# EAGLE design VauTRIOv1_0 (EAGLE 6.5.0)
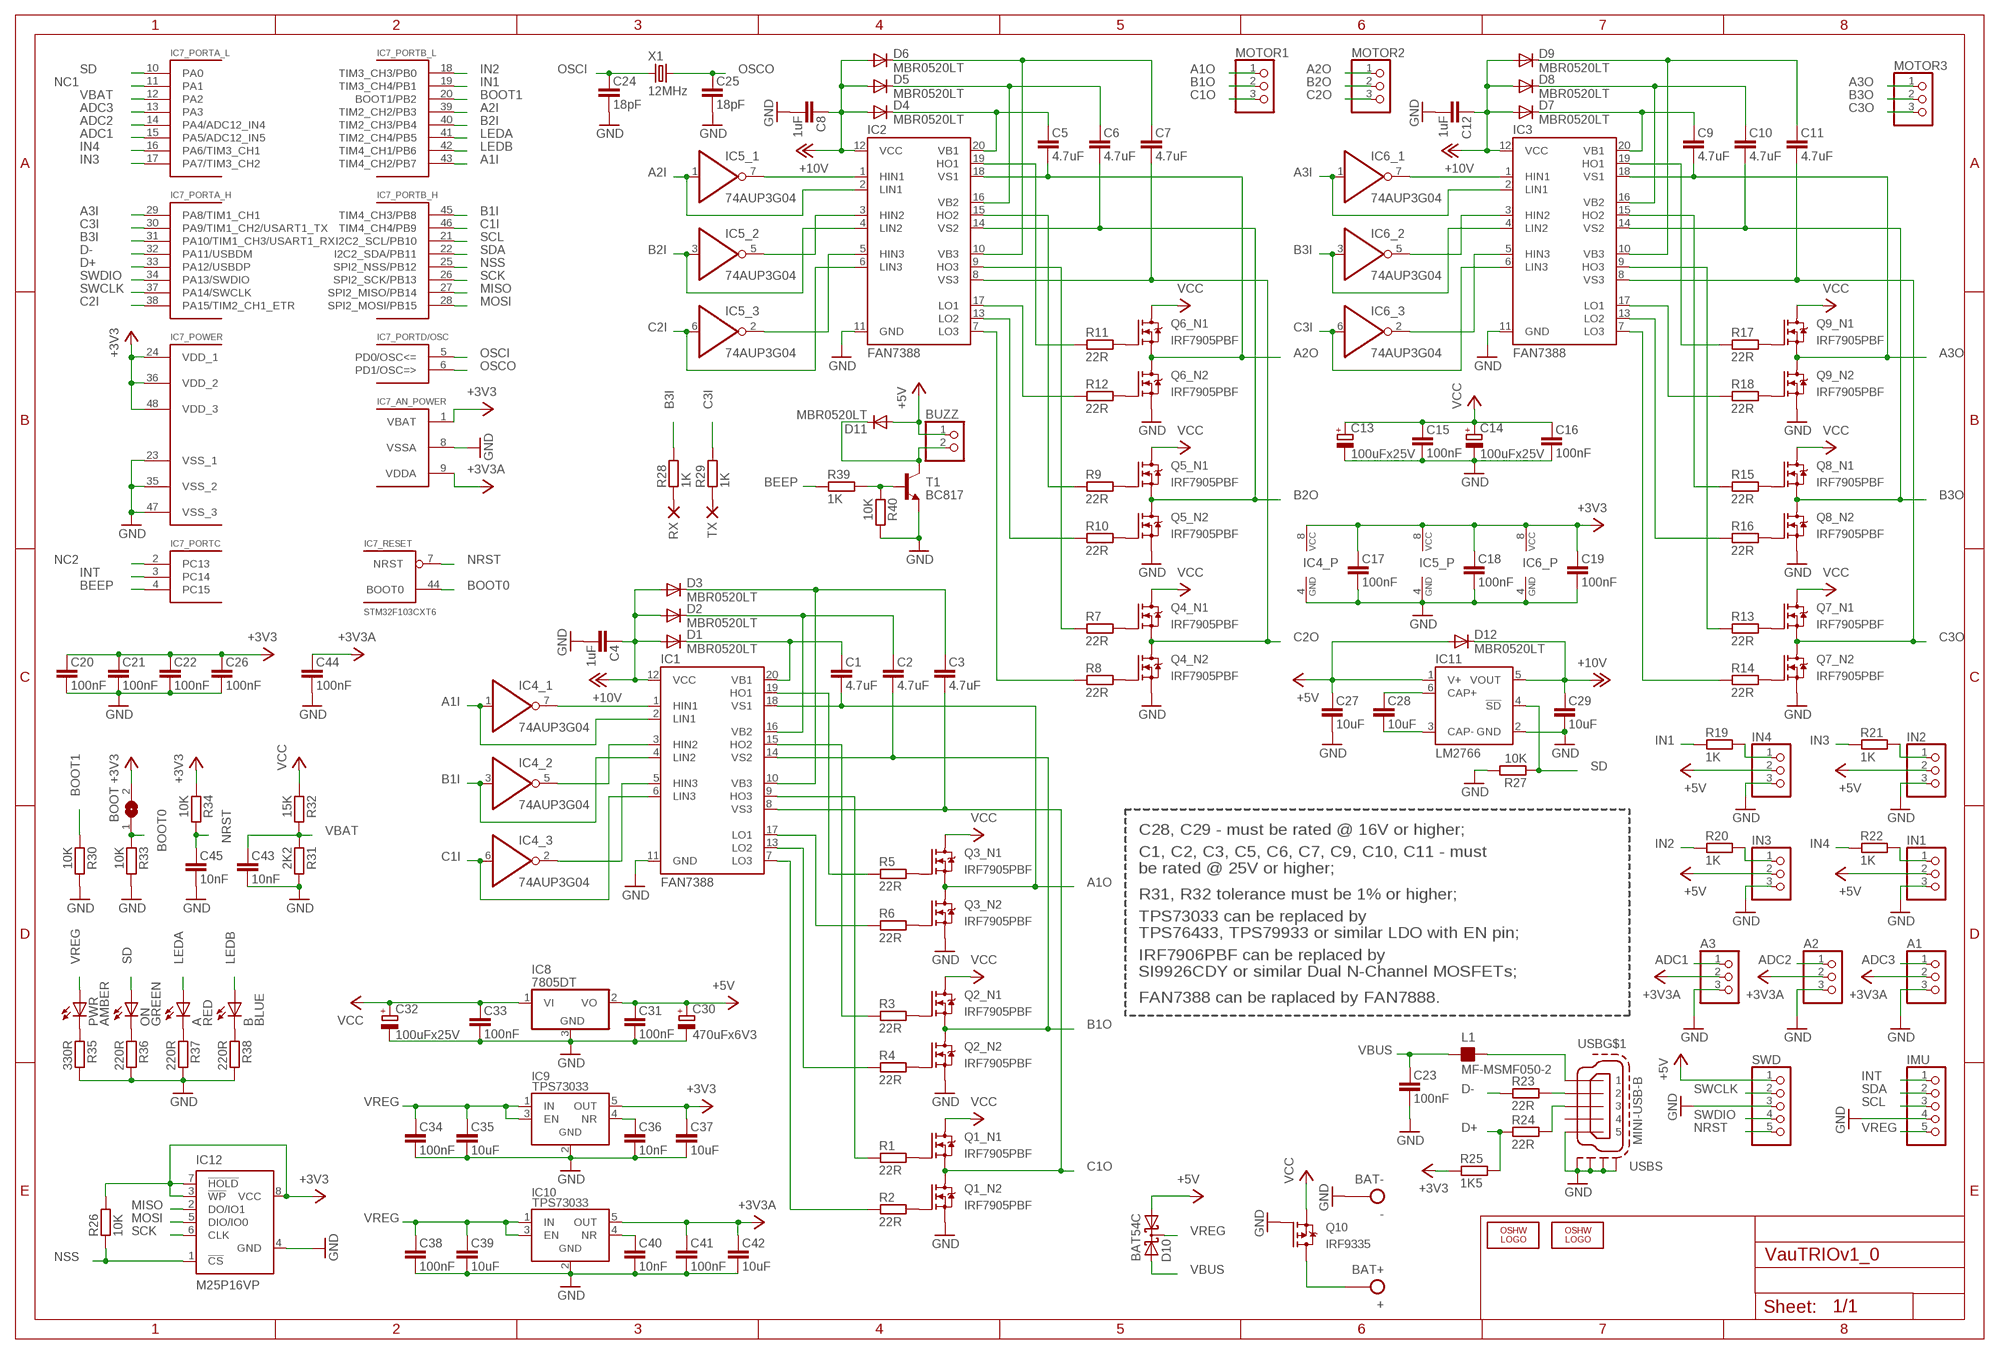
[diagram p0: schematic, sheet 1]

## Parts
+  BAT+  POWER-PAD-20S  [PAD20S]
-  BAT-  POWER-PAD-20R  [PAD20R]
A  RED  LEDCHIPLED_0805  [CHIPLED_0805]
A1  PINHD-1X3  [1X03]
A2  PINHD-1X3  [1X03]
A3  PINHD-1X3  [1X03]
B  BLUE  LEDCHIPLED_0805  [CHIPLED_0805]
BOOT  SJ  [SJ]
BUZZ  PINHD-1X2  [1X02]
C1  4.7uF  C_EU_C0805  [C0805]
C2  4.7uF  C_EU_C0805  [C0805]
C3  4.7uF  C_EU_C0805  [C0805]
C4  1uF  C_EU_C0603G  [C0603G]
C5  4.7uF  C_EU_C0805  [C0805]
C6  4.7uF  C_EU_C0805  [C0805]
C7  4.7uF  C_EU_C0805  [C0805]
C8  1uF  C_EU_C0603G  [C0603G]
C9  4.7uF  C_EU_C0805  [C0805]
C10  4.7uF  C_EU_C0805  [C0805]
C11  4.7uF  C_EU_C0805  [C0805]
C12  1uF  C_EU_C0603G  [C0603G]
C13  100uFx25V  CPOL-EUE2.5-7  [E2,5-7]
C14  100uFx25V  CPOL-EUE2.5-7  [E2,5-7]
C15  100nF  C_EU_C0603G  [C0603G]
C16  100nF  C_EU_C0603G  [C0603G]
C17  100nF  C_EU_C0603G  [C0603G]
C18  100nF  C_EU_C0603G  [C0603G]
C19  100nF  C_EU_C0603G  [C0603G]
C20  100nF  C_EU_C0603G  [C0603G]
C21  100nF  C_EU_C0603G  [C0603G]
C22  100nF  C_EU_C0603G  [C0603G]
C23  100nF  C_EU_C0603G  [C0603G]
C24  18pF  C_EU_C0603G  [C0603G]
C25  18pF  C_EU_C0603G  [C0603G]
C26  100nF  C_EU_C0603G  [C0603G]
C27  10uF  C_EU_C0805G  [C0805G]
C28  10uF  C_EU_C0805  [C0805]
C29  10uF  C_EU_C0805G  [C0805G]
C30  470uFx6V3  CPOL-EUSMCD  [SMC_D]
C31  100nF  C_EU_C0603G  [C0603G]
C32  100uFx25V  CPOL-EUSMCD  [SMC_D]
C33  100nF  C_EU_C0603G  [C0603G]
C34  100nF  C_EU_C0603G  [C0603G]
C35  10uF  C_EU_C0805G  [C0805G]
C36  10nF  C_EU_C0603G  [C0603G]
C37  10uF  C_EU_C0805G  [C0805G]
C38  100nF  C_EU_C0603G  [C0603G]
C39  10uF  C_EU_C0805G  [C0805G]
C40  10nF  C_EU_C0603G  [C0603G]
C41  100nF  C_EU_C0603G  [C0603G]
C42  10uF  C_EU_C0805G  [C0805G]
C43  10nF  C_EU_C0603G  [C0603G]
C44  100nF  C_EU_C0603G  [C0603G]
C45  10nF  C_EU_C0603G  [C0603G]
D1  MBR0520LT  [SOD123]
D2  MBR0520LT  [SOD123]
D3  MBR0520LT  [SOD123]
D4  MBR0520LT  [SOD123]
D5  MBR0520LT  [SOD123]
D6  MBR0520LT  [SOD123]
D7  MBR0520LT  [SOD123]
D8  MBR0520LT  [SOD123]
D9  MBR0520LT  [SOD123]
D10  BAT54C  [SOT23]
D11  MBR0520LT  [SOD123]
D12  MBR0520LT  [SOD123]
IC1  FAN7388  [SOIC-20]
IC2  FAN7388  [SOIC-20]
IC3  FAN7388  [SOIC-20]
IC4  74AUP3G04  [R-PDSO-G8]
IC5  74AUP3G04  [R-PDSO-G8]
IC6  74AUP3G04  [R-PDSO-G8]
IC7  STM32F103CXT6  [LQFP48]
IC8  7805DT  [TO252]
IC9  TPS73033  TPS769XX  [SOT23-5]
IC10  TPS73033  TPS769XX  [SOT23-5]
IC11  LM2766  [SOT23-6]
IC12  M25P16VP  W25X40BVSNIG  [SOIC-8]
IMU  PINHD-1X5  [1X05]
IN1  PINHD-1X3  [1X03]
IN2  PINHD-1X3  [1X03]
IN3  PINHD-1X3  [1X03]
IN4  PINHD-1X3  [1X03]
L1  MF-MSMF050-2  FB_0603  [L0603]
LOGO1  OSHW_LOGO_10MILX0350-NT  [OSHW_10X350_NOTEXT]
LOGO2  OSHW_LOGO_FILLX0150-NT  [OSHW_FILLX150_NOTEXT]
MOTOR1  PINHD-1X3MOT  [1X03M]
MOTOR2  PINHD-1X3MOT  [1X03M]
MOTOR3  PINHD-1X3MOT  [1X03M]
ON  GREEN  LEDCHIPLED_0805  [CHIPLED_0805]
PWR  AMBER  LEDCHIPLED_0805  [CHIPLED_0805]
Q1  IRF7905PBF  [SOIC-8]
Q2  IRF7905PBF  [SOIC-8]
Q3  IRF7905PBF  [SOIC-8]
Q4  IRF7905PBF  [SOIC-8]
Q5  IRF7905PBF  [SOIC-8]
Q6  IRF7905PBF  [SOIC-8]
Q7  IRF7905PBF  [SOIC-8]
Q8  IRF7905PBF  [SOIC-8]
Q9  IRF7905PBF  [SOIC-8]
Q10  IRF9335  [SOIC-8]
R1  22R  R_EU_R0603  [R0603]
R2  22R  R_EU_R0603  [R0603]
R3  22R  R_EU_R0603  [R0603]
R4  22R  R_EU_R0603  [R0603]
R5  22R  R_EU_R0603  [R0603]
R6  22R  R_EU_R0603  [R0603]
R7  22R  R_EU_R0603  [R0603]
R8  22R  R_EU_R0603  [R0603]
R9  22R  R_EU_R0603  [R0603]
R10  22R  R_EU_R0603  [R0603]
R11  22R  R_EU_R0603  [R0603]
R12  22R  R_EU_R0603  [R0603]
R13  22R  R_EU_R0603  [R0603]
R14  22R  R_EU_R0603  [R0603]
R15  22R  R_EU_R0603  [R0603]
R16  22R  R_EU_R0603  [R0603]
R17  22R  R_EU_R0603  [R0603]
R18  22R  R_EU_R0603  [R0603]
R19  1K  R_EU_R0603  [R0603]
R20  1K  R_EU_R0603  [R0603]
R21  1K  R_EU_R0603  [R0603]
R22  1K  R_EU_R0603  [R0603]
R23  22R  R_EU_R0603  [R0603]
R24  22R  R_EU_R0603  [R0603]
R25  1K5  R_EU_R0603  [R0603]
R26  10K  R_EU_R0603  [R0603]
R27  10K  R_EU_R0603G  [R0603G]
R28  1K  R_EU_R0603  [R0603]
R29  1K  R_EU_R0603  [R0603]
R30  10K  R_EU_R0603G  [R0603G]
R31  2K2  R_EU_R0603G  [R0603G]
R32  15K  R_EU_R0603  [R0603]
R33  10K  R_EU_R0603G  [R0603G]
R34  10K  R_EU_R0603  [R0603]
R35  330R  R_EU_R0603G  [R0603G]
R36  220R  R_EU_R0603G  [R0603G]
R37  220R  R_EU_R0603G  [R0603G]
R38  220R  R_EU_R0603G  [R0603G]
R39  1K  R_EU_R0603  [R0603]
R40  10K  R_EU_R0603G  [R0603G]
RX  PAD-SMD10R  [SMD10R]
SWD  PINHD-1X5  [1X05]
T1  BC817  BC817-16LT1SMD  [SOT23-BEC]
TX  PAD-SMD10R  [SMD10R]
USB  MINI-USB-B  MINI-USB-SCHIELD-32005-201  [32005-201]
X1  12MHz  CRYSTALHC49S  [HC49/S]

## Nets
+3V3: BOOT.2 C17.1 C18.1 C19.1 C20.1 C21.1 C22.1 C26.1 C37.1 IC4.8(_P:VCC) IC5.8(_P:VCC) IC6.8(_P:VCC) IC7.1(_AN_POWER:VBAT) IC7.24(_POWER:VDD_1) IC7.36(_POWER:VDD_2) IC7.48(_POWER:VDD_3) IC9.5(OUT) IC12.3(!WP) IC12.7(!HOLD) IC12.8(VCC) R25.1 R26.2 R34.1
+3V3A: A1.2 A2.2 A3.2 C41.1 C42.1 C44.1 IC7.9(_AN_POWER:VDDA) IC10.5(OUT)
+5V: BUZZ.1 C27.1 C30.+ C31.1 D10.1(A1) D11.A D12.A IC8.2(VO) IC11.1(V+) IN1.2 IN2.2 IN3.2 IN4.2 SWD.1
+12V: C4.1 C8.1 C12.1 C29.1 D1.A D2.A D3.A D4.A D5.A D6.A D7.A D8.A D9.A D12.C IC1.12(VCC) IC2.12(VCC) IC3.12(VCC) IC11.5(VOUT) ; supply symbol labelled +10V
A1I: IC1.2(LIN1) IC4.1(_1:A) IC7.43(_PORTB_L:TIM4_CH2/PB7)
A1O [power]: C1.2 IC1.18(VS1) MOTOR1.1 Q3.3(_N1:N-S) Q3.7(_N2:N-D) Q3.8(_N2:N-D)
A2I: IC2.2(LIN1) IC5.1(_1:A) IC7.39(_PORTB_L:TIM2_CH2/PB3)
A2O [power]: C5.2 IC2.18(VS1) MOTOR2.1 Q6.3(_N1:N-S) Q6.7(_N2:N-D) Q6.8(_N2:N-D)
A3I: IC3.2(LIN1) IC6.1(_1:A) IC7.29(_PORTA_H:PA8/TIM1_CH1)
A3O [power]: C9.2 IC3.18(VS1) MOTOR3.1 Q9.3(_N1:N-S) Q9.7(_N2:N-D) Q9.8(_N2:N-D)
ADC1: A3.1 IC7.15(_PORTA_L:PA5/ADC12_IN5)
ADC2: A2.1 IC7.14(_PORTA_L:PA4/ADC12_IN4)
ADC3: A1.1 IC7.13(_PORTA_L:PA3)
B1I: IC1.4(LIN2) IC4.3(_2:A) IC7.45(_PORTB_H:TIM4_CH3/PB8)
B1O [power]: C2.2 IC1.14(VS2) MOTOR1.2 Q2.3(_N1:N-S) Q2.7(_N2:N-D) Q2.8(_N2:N-D)
B2I: IC2.4(LIN2) IC5.3(_2:A) IC7.40(_PORTB_L:TIM2_CH3/PB4)
B2O [power]: C6.2 IC2.14(VS2) MOTOR2.2 Q5.3(_N1:N-S) Q5.7(_N2:N-D) Q5.8(_N2:N-D)
B3I: IC3.4(LIN2) IC6.3(_2:A) IC7.31(_PORTA_H:PA10/TIM1_CH3/USART1_RX) R28.2
B3O [power]: C10.2 IC3.14(VS2) MOTOR3.2 Q8.3(_N1:N-S) Q8.7(_N2:N-D) Q8.8(_N2:N-D)
BAT+ [power]: +.P$1 Q10.5(P-D) Q10.6(P-D) Q10.7(P-D) Q10.8(P-D)
BEEP: IC7.4(_PORTC:PC15) R39.1
BOOT0: BOOT.1 IC7.44(_RESET:BOOT0) R33.1
BOOT1: IC7.20(_PORTB_L:BOOT1/PB2) R30.1
C1I: IC1.6(LIN3) IC4.6(_3:A) IC7.46(_PORTB_H:TIM4_CH4/PB9)
C1O [power]: C3.2 IC1.8(VS3) MOTOR1.3 Q1.3(_N1:N-S) Q1.7(_N2:N-D) Q1.8(_N2:N-D)
C2I: IC2.6(LIN3) IC5.6(_3:A) IC7.38(_PORTA_H:PA15/TIM2_CH1_ETR)
C2O [power]: C7.2 IC2.8(VS3) MOTOR2.3 Q4.3(_N1:N-S) Q4.7(_N2:N-D) Q4.8(_N2:N-D)
C3I: IC3.6(LIN3) IC6.6(_3:A) IC7.30(_PORTA_H:PA9/TIM1_CH2/USART1_TX) R29.2
C3O [power]: C11.2 IC3.8(VS3) MOTOR3.3 Q7.3(_N1:N-S) Q7.7(_N2:N-D) Q7.8(_N2:N-D)
D+: IC7.33(_PORTA_H:PA12/USBDP) R24.1 R25.2
D-: IC7.32(_PORTA_H:PA11/USBDM) R23.1
GND: -.P$1 A1.3 A2.3 A3.3 C4.2 C8.2 C12.2 C13.- C14.- C15.2 C16.2 C17.2 C18.2 C19.2 C20.2 C21.2 C22.2 C23.2 C24.2 C25.2 C26.2 C27.2 C29.2 C30.- C31.2 C32.- C33.2 C34.2 C35.2 C36.2 C37.2 C38.2 C39.2 C40.2 C41.2 C42.2 C43.2 C44.2 C45.2 IC1.11(GND) IC2.11(GND) IC3.11(GND) IC4.4(_P:GND) IC5.4(_P:GND) IC6.4(_P:GND) IC7.8(_AN_POWER:VSSA) IC7.23(_POWER:VSS_1) IC7.35(_POWER:VSS_2) IC7.47(_POWER:VSS_3) IC8.3(GND) IC9.2(GND) IC10.2(GND) IC11.2(GND) IC12.4(GND) IMU.4 IN1.3 IN2.3 IN3.3 IN4.3 Q1.1(_N2:N-S) Q2.1(_N2:N-S) Q3.1(_N2:N-S) Q4.1(_N2:N-S) Q5.1(_N2:N-S) Q6.1(_N2:N-S) Q7.1(_N2:N-S) Q8.1(_N2:N-S) Q9.1(_N2:N-S) Q10.4(P-G) R27.2 R30.2 R31.2 R33.2 R35.2 R36.2 R37.2 R38.2 R40.2 SWD.3 T1.E USB.5 USB.M1(S:S1) USB.M2(S:S2) USB.M3(S:S3) USB.M4(S:S4)
IN1: IC7.19(_PORTB_L:TIM3_CH4/PB1) R19.1
IN2: IC7.18(_PORTB_L:TIM3_CH3/PB0) R20.1
IN3: IC7.17(_PORTA_L:PA7/TIM3_CH2) R21.1
IN4: IC7.16(_PORTA_L:PA6/TIM3_CH1) R22.1
INT: IC7.3(_PORTC:PC14) IMU.1
LEDA: A.A IC7.41(_PORTB_L:TIM2_CH4/PB5)
LEDB: B.A IC7.42(_PORTB_L:TIM4_CH1/PB6)
MISO: IC7.27(_PORTB_H:SPI2_MISO/PB14) IC12.2(DO/IO1)
MOSI: IC7.28(_PORTB_H:SPI2_MOSI/PB15) IC12.5(DIO/IO0)
N$1: IC1.19(HO1) R5.1
N$2: Q5.4(_N1:N-G) R9.2
N$3: Q5.2(_N2:N-G) R10.2
N$4: Q2.4(_N1:N-G) R3.2
N$5: Q2.2(_N2:N-G) R4.2
N$6: Q3.4(_N1:N-G) R5.2
N$7: Q3.2(_N2:N-G) R6.2
N$8: IC1.3(HIN2) IC4.5(_2:Y)
N$9: C1.1 D1.C IC1.20(VB1)
N$10: C2.1 D2.C IC1.16(VB2)
N$11: C3.1 D3.C IC1.10(VB3)
N$12: Q6.4(_N1:N-G) R11.2
N$13: Q6.2(_N2:N-G) R12.2
N$14: IN4.1 R19.2
N$15: Q1.4(_N1:N-G) R1.2
N$16: Q1.2(_N2:N-G) R2.2
N$17: IC1.1(HIN1) IC4.7(_1:Y)
N$18: PWR.C R35.1
N$19: IC1.5(HIN3) IC4.2(_3:Y)
N$20: ON.C R36.1
N$21: R23.2 USB.2
N$22: A.C R37.1
N$23: C5.1 D4.C IC2.20(VB1)
N$24: C6.1 D5.C IC2.16(VB2)
N$25: IC1.17(LO1) R6.1
N$26: IC1.15(HO2) R3.1
N$27: IC1.13(LO2) R4.1
N$28: IC1.7(LO3) R2.1
N$29: IC1.9(HO3) R1.1
N$30: C7.1 D6.C IC2.10(VB3)
N$31: Q4.4(_N1:N-G) R7.2
N$32: Q4.2(_N2:N-G) R8.2
N$33: IC2.1(HIN1) IC5.7(_1:Y)
N$34: IN3.1 R20.2
N$35: IC2.3(HIN2) IC5.5(_2:Y)
N$36: R24.2 USB.3
N$37: IC2.5(HIN3) IC5.2(_3:Y)
N$38: IN2.1 R21.2
N$39: IC2.17(LO1) R12.1
N$40: IC2.15(HO2) R9.1
N$41: IC2.13(LO2) R10.1
N$42: IC2.7(LO3) R8.1
N$43: IC2.9(HO3) R7.1
N$44: IC2.19(HO1) R11.1
N$45: Q8.4(_N1:N-G) R15.2
N$46: Q8.2(_N2:N-G) R16.2
N$47: Q9.4(_N1:N-G) R17.2
N$48: Q9.2(_N2:N-G) R18.2
N$49: IN1.1 R22.2
N$50: C9.1 D7.C IC3.20(VB1)
N$51: C10.1 D8.C IC3.16(VB2)
N$52: C11.1 D9.C IC3.10(VB3)
N$53: Q7.4(_N1:N-G) R13.2
N$54: Q7.2(_N2:N-G) R14.2
N$55: IC3.1(HIN1) IC6.7(_1:Y)
N$56: L1.2 USB.1
N$57: IC3.3(HIN2) IC6.5(_2:Y)
N$58: B.C R38.1
N$59: IC3.5(HIN3) IC6.2(_3:Y)
N$60: BUZZ.2 D11.C T1.C
N$61: IC3.17(LO1) R18.1
N$62: IC3.15(HO2) R15.1
N$63: IC3.13(LO2) R16.1
N$64: IC3.7(LO3) R14.1
N$65: IC3.9(HO3) R13.1
N$66: IC3.19(HO1) R17.1
N$68: C28.1 IC11.6(CAP+)
N$69: C28.2 IC11.3(CAP-)
N$70: R28.1 RX.PAD(P)
N$71: R29.1 TX.PAD(P)
N$72: R39.2 R40.1 T1.B
N$76: C40.1 IC10.4(NR)
N$77: C36.1 IC9.4(NR)
NC1: IC7.11(_PORTA_L:PA1)
NC2: IC7.2(_PORTC:PC13)
NRST: C45.1 IC7.7(_RESET:NRST) R34.2 SWD.5
NSS: IC7.25(_PORTB_H:SPI2_NSS/PB12) IC12.1(!CS) R26.1
OSCI: C24.1 IC7.5(_PORTD/OSC:PD0/OSC<=) X1.1
OSCO: C25.1 IC7.6(_PORTD/OSC:PD1/OSC=>) X1.2
SCK: IC7.26(_PORTB_H:SPI2_SCK/PB13) IC12.6(CLK)
SCL: IC7.21(_PORTB_H:I2C2_SCL/PB10) IMU.3
SD: IC7.10(_PORTA_L:PA0) IC11.4(!SD) ON.A R27.1
SDA: IC7.22(_PORTB_H:I2C2_SDA/PB11) IMU.2
SWCLK: IC7.37(_PORTA_H:PA14/SWCLK) SWD.2
SWDIO: IC7.34(_PORTA_H:PA13/SWDIO) SWD.4
VBAT: C43.1 IC7.12(_PORTA_L:PA2) R31.1 R32.2
VBUS: C23.1 D10.2(A2) L1.1
VCC [power]: C13.+ C14.+ C15.1 C16.1 C32.+ C33.1 IC8.1(VI) Q1.5(_N1:N-D) Q1.6(_N1:N-D) Q2.5(_N1:N-D) Q2.6(_N1:N-D) Q3.5(_N1:N-D) Q3.6(_N1:N-D) Q4.5(_N1:N-D) Q4.6(_N1:N-D) Q5.5(_N1:N-D) Q5.6(_N1:N-D) Q6.5(_N1:N-D) Q6.6(_N1:N-D) Q7.5(_N1:N-D) Q7.6(_N1:N-D) Q8.5(_N1:N-D) Q8.6(_N1:N-D) Q9.5(_N1:N-D) Q9.6(_N1:N-D) Q10.1(P-S) Q10.2(P-S) Q10.3(P-S) R32.1
VREG: C34.1 C35.1 C38.1 C39.1 D10.3(CC) IC9.1(IN) IC9.3(EN) IC10.1(IN) IC10.3(EN) IMU.5 PWR.A
Unconnected: USB.4

## Notes on the sheet
- C28, C29 - must be rated @ 16V or higher;
- C1, C2, C3, C5, C6, C7, C9, C10, C11 - must
  be rated @ 25V or higher;
- R31, R32 tolerance must be 1% or higher;
- TPS73033 can be replaced by
  TPS76433, TPS79933 or similar LDO with EN pin;
- IRF7906PBF can be replaced by
  SI9926CDY or similar Dual N-Channel MOSFETs;
- FAN7388 can be raplaced by FAN7888.

## Library data of the parts
+ - = svBGC:POWER-PAD
A B ON PWR = svBGC:LED
A1-A3 IN1-IN4 MOTOR1-MOTOR3 = svBGC:PINHD-1X3: PIN HEADER
BOOT = svBGC:SJ: SMD solder JUMPER
BUZZ = svBGC:PINHD-1X2: PIN HEADER
C1-C12 C15-C29 C31 C33-C45 = svBGC:C_EU_
C13 C14 C30 C32 = svBGC:CPOL-EU: POLARIZED CAPACITOR, European symbol
D1-D9 D11 D12 = svBGC:MBR0520LT: SCHOTTKY BARRIER RECTIFIER Source: http://onsemi.com .. MBR0520LT1-D.pdf
D10 = svBGC:BAT54C: Schottky Diodes Source: Fairchild .. BAT54.pdf
IC1-IC3 = svBGC:FAN7388: FAIRCHILD SEMICONDUCTORS 3 Half-Bridge Gate-Drive IC
IC4-IC6 = svBGC:74*3G04
IC7 = svBGC:STM32F103CXT6
IC8 = linear:78*: Positive VOLTAGE REGULATOR Source: http://cache.national.com/ds/LM/LM78L05.pdf http://www.fairchildsemi.com/ds/LM/LM7805.pdf
IC9 IC10 = svBGC:TPS769XX: Texas Instruments LDO Regulator
IC11 = svBGC:LM2766: LM2766 - Switched Capacitor Voltage Converter
IC12 = svBGC:W25X: Winbond SPI Flash Memory
IMU SWD = svBGC:PINHD-1X5: PIN HEADER
L1 = svBGC:FB_: FERRITE BEAD
LOGO1 = ohw-logo:OSHW_LOGO_10MIL
LOGO2 = ohw-logo:OSHW_LOGO_FILL
Q1-Q9 = svBGC:IRF7905
Q10 = svBGC:IRF9335
R1-R40 = svBGC:R_EU_
RX TX = dpads:PAD: WIRE PAD Standard US Drill Sizes and SMD pads
T1 = svBGC:BC817*: NPN Transistor
USB = svBGC:MINI-USB-SCHIELD-: MINI USB-B Conector Source: www.cypressindustries.com; OC_FARNELL: unknown; OC_NEWARK: unknown
X1 = svBGC:CRYSTAL: CRYSTAL; OC_FARNELL: 1667008; OC_NEWARK: unknown

## Net classes
0 default: width 0.203 mm, drill 0.305 mm, clearance 0.203 mm
1 power: width 0.254 mm, drill 0.305 mm, clearance 0.305 mm

## Board
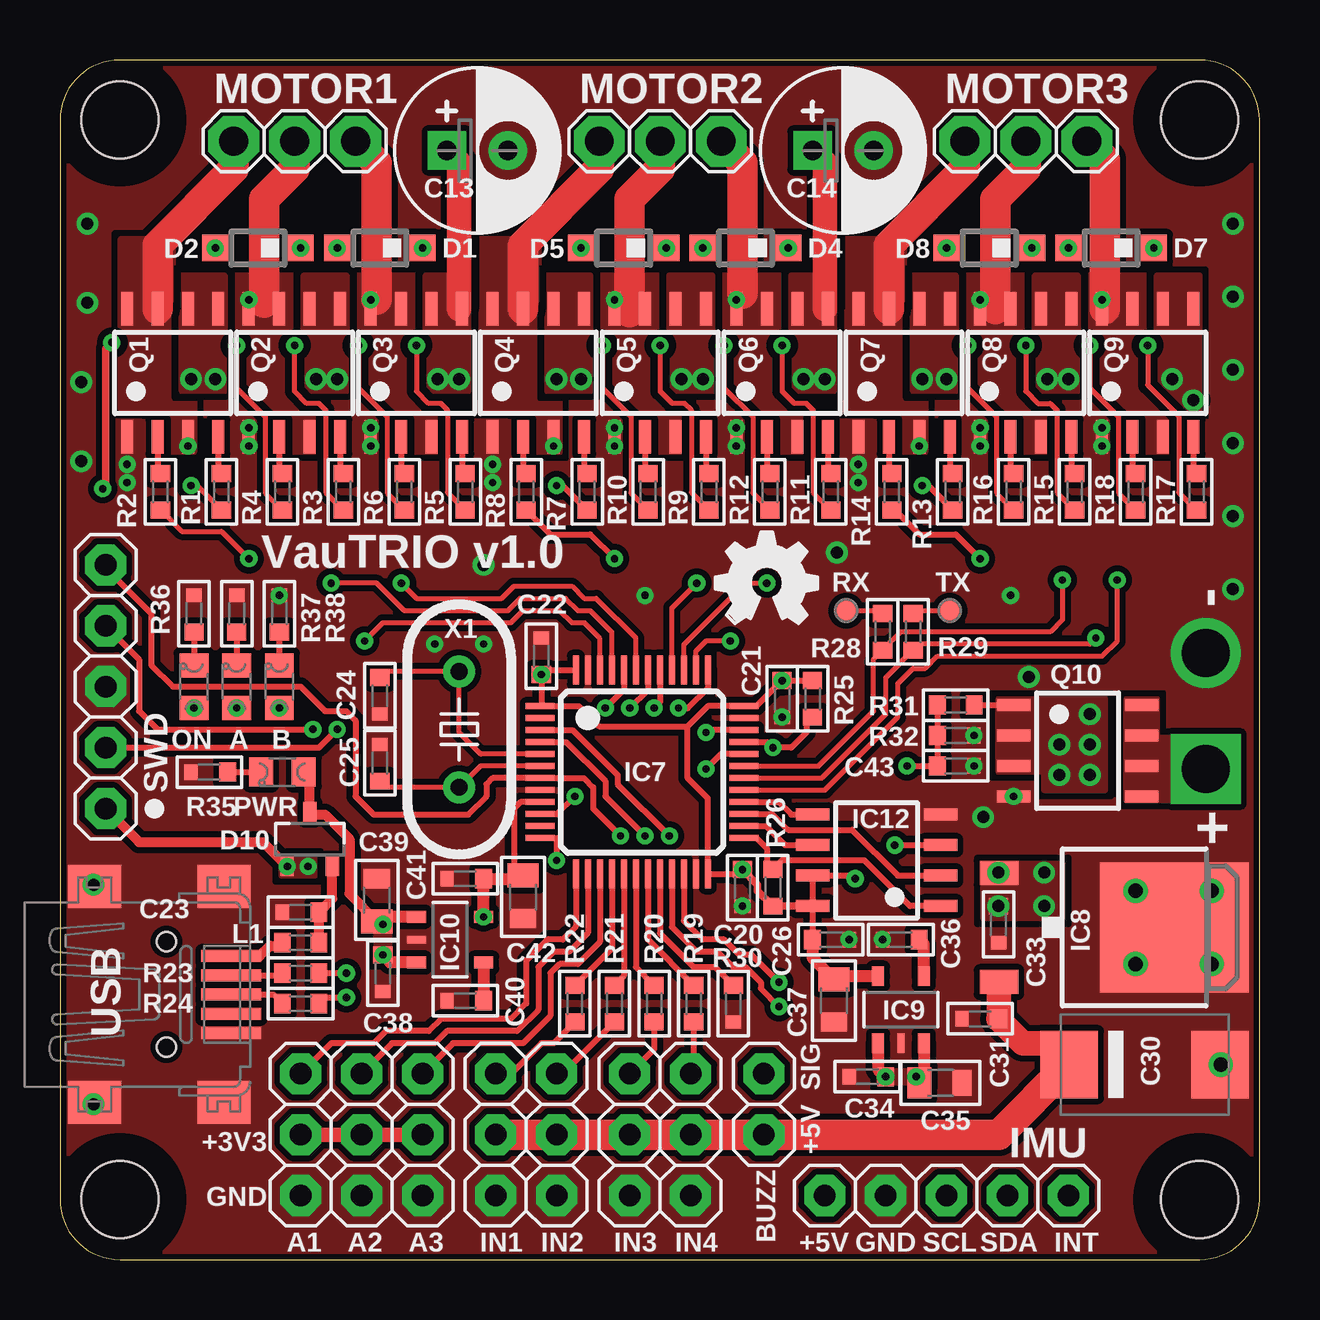
[diagram p1: board, top side]
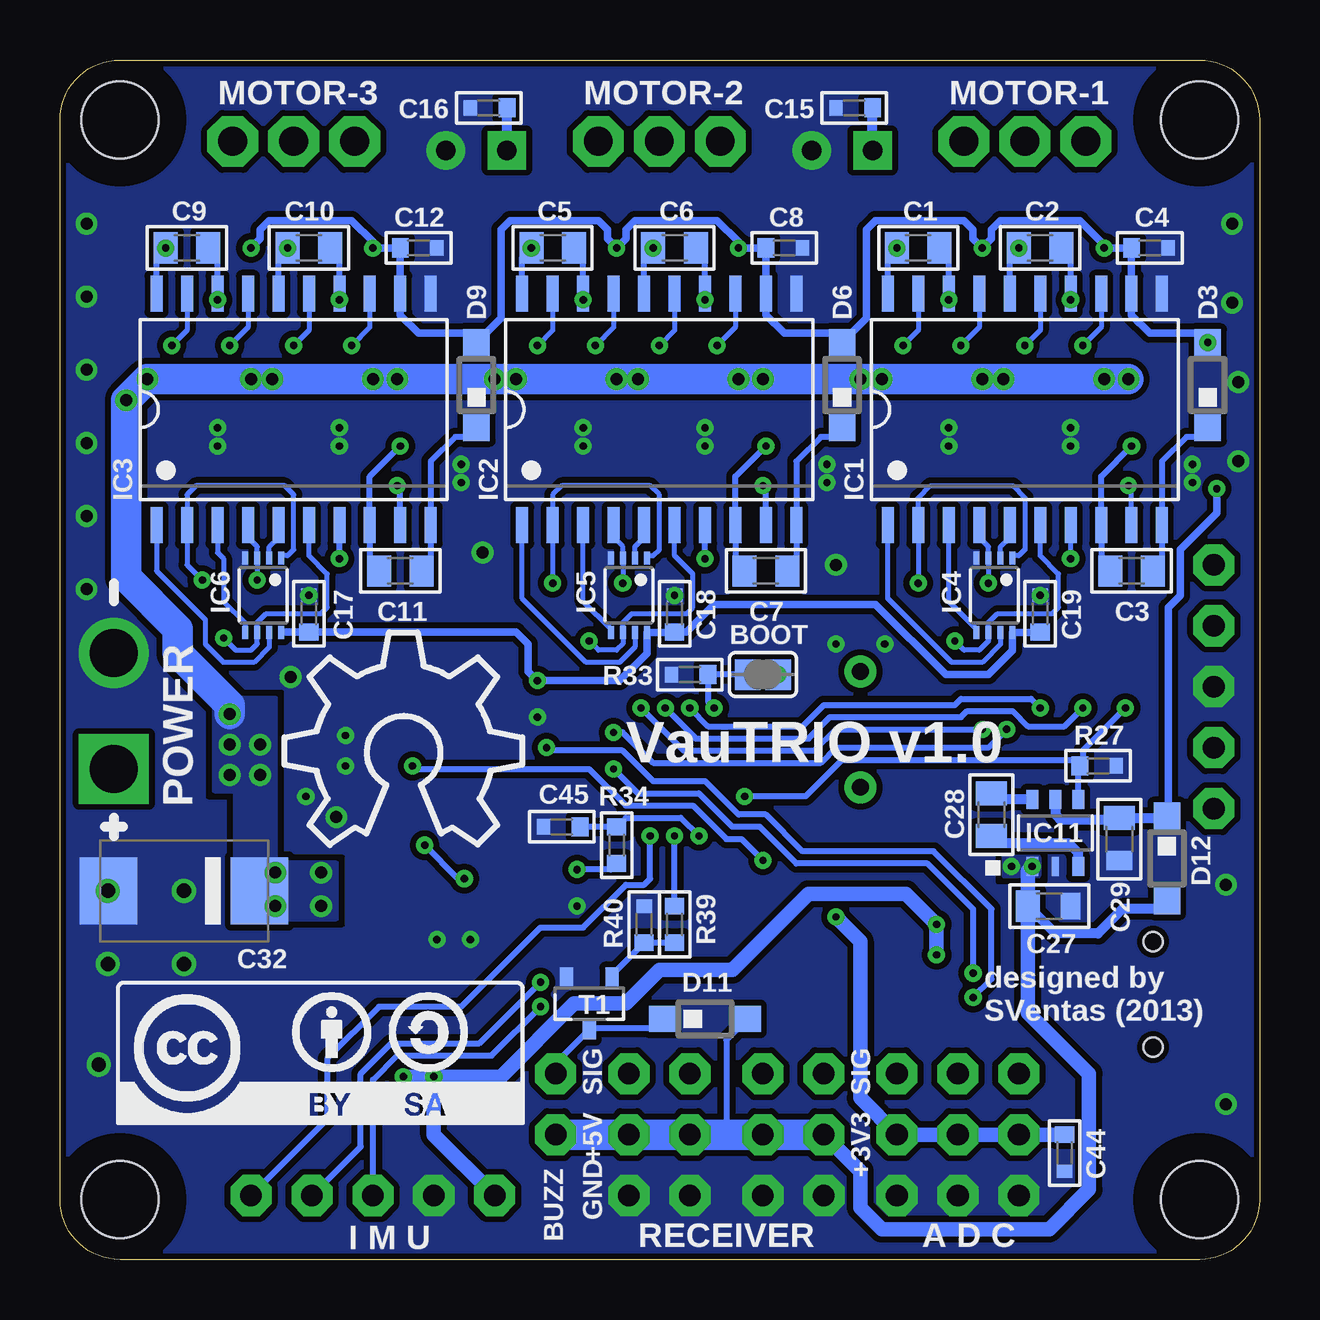
[diagram p2: board, bottom side, seen from below]

Size 50 x 50 mm. Coordinates in mm from the lower left corner, seen from the top.
Outline: 2.5,0 47.5,0 arc90 50,2.5 50,47.5 arc90 47.5,50 2.5,50 arc90 0,47.5 0,2.5 arc90 2.5,0
Copper layers (1*16): Top 0.035mm / dielectric 1.5mm / Bottom 0.035mm
Design rules "default *": minimum track width 8mil, minimum drill 12mil, track to track 8mil, track to pad 8mil, pad to pad 8mil, via to via 8mil, smd to smd 0mil, copper to edge 10mil, drill to drill 8mil, minimum pad ring 10mil, minimum via ring 8mil, stop-mask expansion 4mil, vias tented up to drill 20mil, thermal gap 10mil
Holes 3.2 mm at 2.5,47.5 47.5,47.5 2.5,2.5 47.5,2.5
tRestrict: area 0,45 to 5,50; area 45,45 to 50,50; area 45,0 to 50,5; area 0,0 to 5,5
bRestrict: area 0,45 to 5,50; area 45,45 to 50,50; area 45,0 to 50,5; area 0,0 to 5,5

### Footprints (pad centres in the part's own frame; a part is rotated, then mirrored left to right if it is on the bottom)
PAD20S = drill 2 square: P$1 0,0
PAD20R = drill 2: P$1 0,0
CHIPLED_0805 = smd 1.2 x 1: A 0,-0.889; C 0,0.889
1X03 = drill 0.9 octagon: 1 -2.54,0; 2 0,0; 3 2.54,0
SJ = smd 1.067 x 1.27: 1 -0.635,0; 2 0.635,0
1X02 = drill 0.9 octagon: 1 -1.27,0; 2 1.27,0
C0805 = smd 1 x 1.3: 1 -0.889,0; 2 0.889,0
C0603G = smd 0.7 x 0.8: 1 -0.762,0 | smd 0.548 x 0.648: 2 0.762,0
E2,5-7 = drill 0.813 pad 1.6 square: + -1.27,0 | drill 0.813 pad 1.6: - 1.27,0
C0805G = smd 1 x 1.3: 1 -0.889,0 | smd 0.797 x 1.097: 2 0.889,0
SMC_D = smd 2.4 x 2.8: + -3.15,0; - 3.15,0
SOD123 = smd 1.1 x 1.1: A 1.778,0; C -1.778,0
SOT23 = smd 0.55 x 0.8: 1 -0.94,-1.143; 2 0.94,-1.143; 3 0,1.143
SOIC-20 = smd 0.5 x 1.5: 1 -5.715,-4.826; 2 -4.445,-4.826; 3 -3.175,-4.826; 4 -1.905,-4.826; 5 -0.635,-4.826; 6 0.635,-4.826; 7 1.905,-4.826; 8 3.175,-4.826; 9 4.445,-4.826; 10 5.715,-4.826; 11 5.715,4.826; 12 4.445,4.826; 13 3.175,4.826; 14 1.905,4.826; 15 0.635,4.826; 16 -0.635,4.826; 17 -1.905,4.826; 18 -3.175,4.826; 19 -4.445,4.826; 20 -5.715,4.826
R-PDSO-G8 = smd 0.25 x 0.55: 1 -0.75,-1.55; 2 -0.25,-1.55; 3 0.25,-1.55; 4 0.75,-1.55; 5 0.75,1.55; 6 0.25,1.55; 7 -0.25,1.55; 8 -0.75,1.55
LQFP48 = smd 0.25 x 1.2: 1 -2.75,-4.25; 2 -2.25,-4.25; 3 -1.75,-4.25; 4 -1.25,-4.25; 5 -0.75,-4.25; 6 -0.25,-4.25; 7 0.25,-4.25; 8 0.75,-4.25; 9 1.25,-4.25; 10 1.75,-4.25; 11 2.25,-4.25; 12 2.75,-4.25; 25 2.75,4.25; 26 2.25,4.25; 27 1.75,4.25; 28 1.25,4.25; 29 0.75,4.25; 30 0.25,4.25; 31 -0.25,4.25; 32 -0.75,4.25; 33 -1.25,4.25; 34 -1.75,4.25; 35 -2.25,4.25; 36 -2.75,4.25 | smd 1.2 x 0.25: 13 4.25,-2.75; 14 4.25,-2.25; 15 4.25,-1.75; 16 4.25,-1.25; 17 4.25,-0.75; 18 4.25,-0.25; 19 4.25,0.25; 20 4.25,0.75; 21 4.25,1.25; 22 4.25,1.75; 23 4.25,2.25; 24 4.25,2.75; 37 -4.25,2.75; 38 -4.25,2.25; 39 -4.25,1.75; 40 -4.25,1.25; 41 -4.25,0.75; 42 -4.25,0.25; 43 -4.25,-0.25; 44 -4.25,-0.75; 45 -4.25,-1.25; 46 -4.25,-1.75; 47 -4.25,-2.25; 48 -4.25,-2.75
TO252 = smd 1 x 1.6: 1 -2.28,-4.8; 2 2.28,-4.8 | smd 5.4 x 6.2: 3 0,2.5
SOT23-5 = smd 0.5 x 0.8: 1 -0.95,-1.397; 3 0.95,-1.397; 4 0.95,1.397; 5 -0.95,1.397 | smd 0.297 x 0.8: 2 0,-1.397
SOT23-6 = smd 0.5 x 0.8: 1 -0.95,-1.397; 3 0.95,-1.397; 4 0.95,1.397; 5 0,1.397; 6 -0.95,1.397 | smd 0.297 x 0.8: 2 0,-1.397
SOIC-8 = smd 0.5 x 1.4: 1 -1.905,-2.667; 2 -0.635,-2.667; 3 0.635,-2.667; 4 1.905,-2.667; 5 1.905,2.667; 6 0.635,2.667; 7 -0.635,2.667; 8 -1.905,2.667
1X05 = drill 0.9 octagon: 1 -5.08,0; 2 -2.54,0; 3 0,0; 4 2.54,0; 5 5.08,0
L0603 = smd 0.7 x 0.8: 1 -0.762,0; 2 0.762,0
1X03M = drill 1.2 octagon: 1 -2.54,0; 2 0,0; 3 2.54,0
R0603 = smd 0.7 x 0.8: 1 -0.762,0; 2 0.762,0
R0603G = smd 0.7 x 0.8: 1 -0.762,0 | smd 0.548 x 0.648: 2 0.762,0
SMD10R = smd 1 x 1: PAD 0,0
SOT23-BEC = smd 0.55 x 0.8: B -0.95,-1.1; C 0,1.1; E 0.95,-1.1
32005-201 = smd 2.5 x 0.5: 1 2.7,1.6; 2 2.7,0.8; 3 2.7,0; 4 2.7,-0.8; 5 2.7,-1.6 | smd 2.2 x 1.8: M1 -3,-4.5; M2 -3,4.5; M3 2.4,4.5; M4 2.4,-4.5 | hole 0.8: 0,2.2; 0,-2.2
HC49/S = drill 0.7: 1 -2.413,0; 2 2.413,0

### Placement (x,y rotation side)
+  47.75,20.45 0 top
-  47.75,25.27 0 top
A  7.37,23.88 0 top
A1  10.03,5.21 270 top
A2  12.57,5.21 270 top
A3  15.11,5.21 270 top
B  9.14,23.88 0 top
BOOT  20.7,24.38 0 bottom
BUZZ  29.34,6.48 90 top
C1  14.22,42.16 0 bottom
C2  9.14,42.16 0 bottom
C3  5.33,28.7 180 bottom
C4  4.57,42.16 0 bottom
C5  29.46,42.16 0 bottom
C6  24.38,42.16 0 bottom
C7  20.57,28.7 180 bottom
C8  19.81,42.16 0 bottom
C9  44.7,42.16 0 bottom
C10  39.62,42.16 0 bottom
C11  35.81,28.7 180 bottom
C12  35.05,42.16 0 bottom
C13  17.4,46.23 0 top
C14  32.64,46.23 0 top
C15  16.89,48.01 180 bottom
C16  32.13,48.01 180 bottom
C17  39.62,26.92 90 bottom
C18  24.38,26.92 90 bottom
C19  9.14,26.92 90 bottom
C20  28.45,15.49 270 top
C21  30.1,23.37 270 top
C22  20.07,25.15 90 top
C23  10.03,14.48 180 top
C24  13.34,23.5 270 top
C25  13.34,20.7 90 top
C26  32.13,13.34 0 top
C27  8.76,14.73 0 bottom
C28  11.18,18.54 270 bottom
C29  5.84,17.53 270 bottom
C30  45.21,8.13 0 top
C31  38.35,10.03 180 top
C32  44.83,15.37 180 bottom
C33  39.12,13.97 270 top
C34  33.66,7.62 180 top
C35  36.7,7.37 0 top
C36  35.05,13.34 180 top
C37  32.26,10.79 270 top
C38  13.46,11.94 270 top
C39  13.21,14.99 90 top
C40  16.89,10.79 180 top
C41  16.89,15.88 180 top
C42  19.3,15.11 270 top
C43  37.34,20.57 0 top
C44  8.13,4.45 270 bottom
C45  29.08,18.03 180 bottom
D1  13.34,42.16 180 top
D2  8.26,42.16 180 top
D3  2.16,36.45 90 bottom
D4  28.57,42.16 180 top
D5  23.5,42.16 180 top
D6  17.4,36.45 90 bottom
D7  43.81,42.16 180 top
D8  38.73,42.16 180 top
D9  32.64,36.45 90 bottom
D10  10.41,17.53 0 top
D11  23.11,10.03 0 bottom
D12  3.86,16.72 270 bottom
IC1  9.78,35.43 0 bottom
IC2  25.02,35.43 0 bottom
IC3  40.26,35.43 0 bottom
IC4  11.05,27.69 180 bottom
IC5  26.29,27.69 180 bottom
IC6  41.53,27.69 180 bottom
IC7  24.26,20.32 270 top
IC8  43.94,13.84 270 top
IC9  35.05,10.41 0 top
IC10  16.26,13.34 270 top
IC11  8.51,17.78 0 bottom
IC12  34.04,16.64 90 top
IMU  36.96,2.67 180 top
IN1  18.16,5.21 270 top
IN2  20.7,5.21 270 top
IN3  23.75,5.21 270 top
IN4  26.29,5.21 270 top
L1  10.03,13.21 180 top
LOGO1  40.64,17.27 0 bottom
LOGO2  27.33,26.52 0 top
MOTOR1  9.78,46.61 180 top
MOTOR2  25.02,46.61 180 top
MOTOR3  40.26,46.61 180 top
ON  5.59,23.88 0 top
PWR  9.27,20.32 90 top
Q1  4.7,36.96 0 top
Q2  9.78,36.96 0 top
Q3  14.86,36.96 0 top
Q4  19.94,36.96 0 top
Q5  25.02,36.96 0 top
Q6  30.1,36.96 0 top
Q7  35.18,36.96 0 top
Q8  40.26,36.96 0 top
Q9  45.34,36.96 0 top
Q10  42.42,21.21 270 top
R1  6.73,32 90 top
R2  4.19,32 90 top
R3  11.81,32 90 top
R4  9.27,32 90 top
R5  16.89,32 90 top
R6  14.35,32 90 top
R7  21.97,32 90 top
R8  19.43,32 90 top
R9  27.05,32 90 top
R10  24.51,32 90 top
R11  32.13,32 90 top
R12  29.59,32 90 top
R13  37.21,32 90 top
R14  34.67,32 90 top
R15  42.29,32 90 top
R16  39.75,32 90 top
R17  47.37,32 90 top
R18  44.83,32 90 top
R19  26.42,10.67 270 top
R20  24.77,10.67 270 top
R21  23.11,10.67 270 top
R22  21.46,10.67 270 top
R23  10.03,11.94 180 top
R24  10.03,10.67 180 top
R25  31.37,23.37 270 top
R26  29.72,15.49 270 top
R27  6.73,20.57 0 bottom
R28  34.29,26.16 270 top
R29  35.56,26.16 270 top
R30  28.07,10.67 270 top
R31  37.34,21.84 0 top
R32  37.34,23.11 180 top
R33  23.75,24.38 180 bottom
R34  26.8,17.27 90 bottom
R35  6.22,20.32 180 top
R36  5.59,26.92 90 top
R37  7.37,26.92 90 top
R38  9.14,26.92 90 top
R39  24.38,13.97 270 bottom
R40  25.65,13.97 90 bottom
RX  32.77,27.05 0 top
SWD  1.91,23.88 90 top
T1  27.94,10.67 180 bottom
TX  37.08,27.05 0 top
USB  4.45,11.05 0 top
X1  16.64,22.1 270 top

### Tracks (layer width: path | path; a pad name or v marks a point on that pad's centre or on a via)
+3V3  (via drill 0.3, 0.3 pad 0.71)
  Top 0.254: IC7.48 20.07,24.57 BOOT.2 20.07,23.07 IC7.1 21.63,23.07 22.48,22.23 26.16,22.23 | R25.1 C21.1 29.04,23.07 IC7.36 27.01,23.07 26.16,22.23 | C26.1 IC12.8 IC12.7 33.02,16 v33.15,15.88 | v34.8,17.27 IC12.3 | C20.1 28.45,16.07 IC7.24 27.01,19.22 26.16,20.07 26.16,22.23
  Top 0.305: C20.1 29.08,15.62 29.08,15.37 R26.2 IC12.8
  Top 0.508: IC9.5 32.38,11.81 C37.1 31.37,12.57 C26.1
  Bottom 0.203: 9.17,26.14 C19.1 | 24.41,26.14 C18.1 | IC6.8 40.77,26.16
  Bottom 0.254: v33.15,15.88 33.4,15.88 v34.8,17.27 | R34.1 27.05,16.26 C20.1
  Bottom 0.305: 9.17,26.14 IC4.8 10.3,25.39 11.3,24.38 13.08,24.38 16,27.3 22.73,27.3 23.88,26.16 C18.1 | 24.41,26.14 IC5.8 25.54,25.26 26.67,24.13 C21.1 30.48,24.51 30.48,25.65 30.99,26.16 C17.1 40.77,26.16
  other vias: 28.45,16.26 20.07,24.38 30.1,24.13
+3V3A  (via drill 0.3)
  Top 0.254: IC7.9 19.2,19.07 18.92,18.8 18.92,16.38 C42.1
  Top 0.508: IC10.5 C41.1 19.18,15.88 C42.1
  Top 0.61: A1.2 A2.2 A3.2
  Bottom 0.61: IC10.5 16.64,13.27 16.64,6.73 A3.2 A2.2 A1.2 C44.1
  other vias: 17.65,14.29
+5V  (via drill 0.3)
  Top 0.406: SWD.1 3.3,17.4 8.46,17.4 D10.1
  Top 1.016: IC8.2 39.14,10.06 C31.1 40.13,9.02 41.17,9.02 C30.+
  Top 1.27: IN1.2 IN2.2 IN3.2 IN4.2 BUZZ.1 39.14,5.21 C30.+
  Bottom 0.254: D11.A 22.23,9.14 22.23,5.21
  Bottom 0.406: D12.A 4.19,14.61 5.71,14.61 6.73,13.59 8.51,13.59 C27.1
  Bottom 0.61: IN1.2 16.64,3.68 16.64,2.16 15.75,1.27 8.76,1.27 7.11,2.92 7.11,7.75 9.65,10.29 C27.1 9.65,16.19 IC11.1
  Bottom 1.27: IN1.2 IN2.2 22.23,5.21 IN3.2 IN4.2 BUZZ.1
  other vias: 9.47,16.38 10.34,16.38
  pour Top (no thermals): 10.62,16.76 9.22,16.76 9.22,16 10.62,16
  pour Bottom (no thermals): 10.62,16.76 9.22,16.76 9.22,16 10.62,16
+12V  (via drill 0.3)
  Top 0.305: D3.A 1.91,37.97 1.91,32.26 v1.78,32.13
  Bottom 0.305: D7.A 41.66,42.55 41.66,42.93 41.27,43.31 37.85,43.31 36.96,42.42 D8.A C12.1 IC3.12 35.81,39.37 35.05,38.61 33.02,38.61 D9.A 31.62,39.24 31.62,42.93 31.24,43.31 27.56,43.31 27.18,42.93 27.18,42.55 D4.A 26.42,42.55 26.42,42.93 26.04,43.31 22.61,43.31 21.72,42.42 D5.A C8.1 IC2.12 20.57,39.37 19.81,38.61 17.78,38.61 D6.A 16.38,39.24 16.38,42.93 16,43.31 12.32,43.31 11.94,42.93 11.94,42.55 D1.A 11.18,42.55 11.18,42.93 10.79,43.31 7.49,43.31 6.48,42.29 D2.A C4.1 IC1.12 5.33,39.37 4.57,38.61 2.54,38.61 D3.A | v1.78,32.13 1.78,31.11 3.3,29.59 3.3,27.69 3.81,27.18 3.81,18.55 D12.C 3.94,18.41
  Bottom 0.406: IC11.5 8.51,18.54 8.31,18.34 5.92,18.34 C29.1 3.94,18.41
  other vias: 6.48,42.16 11.56,42.16 21.72,42.16 26.8,42.16 36.96,42.16 42.04,42.16 2.16,38.23
A1I  (via drill 0.3)
  Top 0.203: v14.22,28.19 14.86,27.56 18.41,27.56 18.92,28.07 21.34,28.07 21.84,27.56 22.35,27.56 24.01,25.9 IC7.43
  Bottom 0.203: IC4.1 10.3,29.34 10.03,29.34 9.78,29.59 9.78,31.75 10.29,32.26 13.72,32.26 14.22,31.75 IC1.2 v14.22,28.19
A1O  (via drill 0.3)
  Top 1.27: MOTOR1.1 13.21,45.72 13.21,40.01
  Bottom 0.254: C1.2 12.95,41.78 IC1.18 v12.95,40.01
  pour Top (rank 2, no thermals): 12.32,41.02 14.86,41.02 14.86,36.2 15.75,36.2 15.75,33.66 13.97,33.66 13.97,35.43 12.32,35.43
A2I  (via drill 0.3)
  Top 0.203: 29.34,28.19 v29.46,28.19 28.57,28.19 26.01,25.63 IC7.39
  Bottom 0.203: IC5.1 25.54,29.34 25.27,29.34 25.02,29.59 25.02,31.88 25.4,32.26 29.08,32.26 29.46,31.88 IC2.2 v29.46,28.19
A2O  (via drill 0.3)
  Top 1.27: MOTOR2.1 28.45,45.72 28.45,40.26
  Bottom 0.254: C5.2 28.19,41.78 IC2.18 v28.19,40.01
  pour Top (rank 2, no thermals): 27.56,41.02 30.1,41.02 30.1,36.2 30.99,36.2 30.99,33.66 29.21,33.66 29.21,35.43 27.56,35.43
A3I  (via drill 0.3)
  Top 0.203: IC7.29 31.89,19.57 34.92,22.61 34.92,24 35.56,24.64 36.07,24.64 36.58,25.15 43.43,25.15 44.07,25.78 v44.07,28.32
  Bottom 0.203: IC6.1 40.78,29.34 40.51,29.34 40.26,29.59 40.26,31.88 40.64,32.26 44.32,32.26 44.7,31.88 IC3.2 44.7,28.96 v44.07,28.32
A3O  (via drill 0.3)
  Top 1.27: MOTOR3.1 43.56,45.85 43.56,39.62
  Bottom 0.254: C9.2 43.43,41.78 IC3.18 v43.43,40.01
  pour Top (rank 2, no thermals): 42.8,41.02 45.47,41.02 45.47,36.2 46.23,35.43 46.23,33.66 44.45,33.66 44.45,35.43 42.8,35.43
ADC1
  Top 0.254: IC7.15 22.51,13.24 21.59,12.32 20.83,12.32 20.45,11.94 20.45,10.16 19.3,9.02 16.38,9.02 A3.1
ADC2
  Top 0.254: IC7.14 22.01,13.62 21.21,12.83 20.57,12.83 19.94,12.19 19.94,10.41 19.05,9.53 16.13,9.53 15.62,9.02 13.84,9.02 A2.1
ADC3
  Top 0.254: IC7.13 21.51,13.89 20.95,13.34 20.32,13.34 19.43,12.45 19.43,10.67 18.8,10.03 15.88,10.03 15.37,9.53 13.59,9.53 13.08,9.02 11.3,9.02 A1.1
B1I  (via drill 0.3)
  Top 0.203: v11.3,28.19 13.21,28.19 14.35,27.05 18.67,27.05 19.18,27.56 21.08,27.56 21.59,27.05 22.1,27.05 23.01,26.14 IC7.45
  Bottom 0.203: IC1.4 11.68,30.1 11.3,29.71 IC4.3 v11.3,28.2 v11.3,28.19
B1O  (via drill 0.3)
  Top 1.27: 8.51,39.88 8.51,44.2 9.78,45.47 MOTOR1.2
  Bottom 0.254: C2.2 7.87,41.78 IC1.14 v7.87,40.01
  pour Top (rank 2, no thermals): 7.24,41.02 9.78,41.02 9.78,36.2 10.67,36.2 10.67,33.66 8.89,33.66 8.89,35.43 7.24,35.43
B2I  (via drill 0.3)
  Top 0.203: IC7.40 25.51,27.16 v26.54,28.19
  Bottom 0.203: IC2.4 26.92,30.1 26.54,29.71 IC5.3 v26.54,28.2 v26.54,28.19
B2O  (via drill 0.3)
  Top 1.27: 23.75,39.5 23.75,44.2 25.02,45.47 MOTOR2.2
  Bottom 0.254: C6.2 23.11,41.78 IC2.14 v23.11,40.01
  pour Top (rank 2, no thermals): 22.48,41.02 25.02,41.02 25.02,36.2 25.91,36.2 25.91,33.66 24.13,33.66 24.13,35.43 22.1,35.43
B3I  (via drill 0.3)
  Top 0.203: v41.78,28.32 41.78,26.67 41.27,26.16 35.05,26.16 R28.2 33.91,25.02 33.91,22.86 31.62,20.57 IC7.31
  Bottom 0.203: IC3.4 42.16,30.1 41.78,29.71 IC6.3 v41.78,28.32
B3O  (via drill 0.3)
  Top 1.27: 38.99,39.62 38.99,44.2 40.26,45.47 MOTOR3.2
  Bottom 0.254: C10.2 38.35,41.78 IC3.14 v38.35,40.01
  pour Top (rank 2, no thermals): 37.72,41.02 40.26,41.02 40.26,36.2 41.15,36.2 41.15,33.66 39.37,33.66 39.37,35.43 37.72,35.43
BAT+
  pour Top (no thermals): 44.45,23.37 45.72,23.37 45.72,21.77 49.02,21.77 49.02,19.13 44.45,19.13
BEEP  (via drill 0.3)
  Top 0.254: IC7.4 21.1,21.57 22.73,19.94 22.73,19.3 v24.38,17.65
  Bottom 0.254: R39.1 v24.38,17.65
BOOT0  (via drill 0.3)
  Top 0.254: IC7.44 23.51,23.76 v22.73,22.99
  Bottom 0.254: BOOT.1 R33.1 22.99,23.24 v22.73,22.99
BOOT1
  Top 0.254: IC7.20 25.01,13.6 26.42,12.19 27.3,12.19 R30.1
C1I  (via drill 0.3)
  Top 0.203: v12.7,25.78 13.46,26.54 18.8,26.54 19.3,27.05 20.83,27.05 21.34,26.54 21.84,26.54 22.51,25.88 IC7.46
  Bottom 0.203: IC1.6 9.14,29.34 8.38,28.57 8.38,27.18 8.64,26.92 10.92,26.92 11.3,26.55 IC4.6 11.3,25.79 11.68,25.4 12.32,25.4 v12.7,25.78
C1O  (via drill 0.3)
  Top 1.27: Q1.7 4.06,42.29 7.24,45.47 MOTOR1.3
  Bottom 0.254: C3.2 6.6,29.08 IC1.8 6.6,32.64 v5.33,33.91
  pour Top (rank 2, no thermals): 2.54,42.55 4.7,42.55 4.7,36.2 5.59,36.2 5.59,33.66 3.81,33.66 3.81,35.43 2.54,35.43
C2I  (via drill 0.3)
  Top 0.203: v27.94,25.78 26.92,25.78 26.51,25.36 IC7.38
  Bottom 0.203: IC2.6 24.38,29.34 23.62,28.57 23.62,27.18 23.88,26.92 26.16,26.92 26.54,26.55 IC5.6 26.54,25.66 26.8,25.4 27.56,25.4 v27.94,25.78
C2O  (via drill 0.3)
  Top 0.254: v20.57,33.91 Q4.3
  Top 1.27: Q4.7 19.3,42.29 22.48,45.47 MOTOR2.3
  Bottom 0.254: C7.2 21.84,29.08 IC2.8 21.84,32.64 v20.57,33.91
  pour Top (rank 2, no thermals): 17.4,42.55 19.94,42.55 19.94,36.2 20.83,36.2 20.83,33.66 19.05,33.66 19.05,35.43 17.4,35.43
C3I  (via drill 0.3)
  Top 0.203: IC7.30 31.75,20.07 34.42,22.73 34.42,24.26 R29.2 35.81,25.65 42.93,25.65 v43.18,25.91
  Bottom 0.203: IC3.6 39.62,29.34 38.86,28.57 38.86,27.18 39.12,26.92 41.4,26.92 41.78,26.55 IC6.6 41.78,25.66 42.04,25.4 42.67,25.4 v43.18,25.91
C3O  (via drill 0.3)
  Top 0.254: v35.81,33.91 Q7.3
  Top 1.27: Q7.7 34.54,42.29 37.72,45.47 MOTOR3.3
  Bottom 0.254: C11.2 37.08,29.08 IC3.8 37.08,32.64 v35.81,33.91
  pour Top (rank 2, no thermals): 32.64,42.55 35.18,42.55 35.18,36.07 36.07,36.07 36.07,33.66 34.29,33.66 34.29,35.43 32.64,35.43
D+  (via drill 0.3)
  Top 0.254: v11.94,10.92 11.05,10.92 R24.1 | IC7.33 29.48,21.57 v29.72,21.34 30.48,21.34 31.11,21.97 31.11,22.35 R25.2
  Bottom 0.254: v11.94,10.92 11.18,11.68 11.18,14.61 13.59,17.02 19.05,17.02 20.57,18.54 21.72,18.54 23.11,19.94 25.27,19.94 26.54,21.21 29.59,21.21 v29.72,21.34
D-  (via drill 0.3)
  Top 0.254: R23.1 v11.94,11.94 | IC7.32 27.55,21.07 v26.92,20.45
  Bottom 0.254: v11.94,11.94 11.94,14.61 13.84,16.51 19.3,16.51 20.83,18.03 21.97,18.03 23.37,19.43 25.91,19.43 v26.92,20.45
GND  (via drill 0.3, 0.5, 0.6)
  other vias: 7.87,34.67 7.87,33.91 12.95,34.67 12.95,33.91 2.79,33.15 2.79,32.38 18.03,33.15 18.03,32.38 28.19,34.67 28.19,33.91 23.11,34.67 23.11,33.91 33.27,33.15 33.27,32.38 38.35,34.67 38.35,33.91 43.43,34.67 43.43,33.91 44.83,15.37 48.01,15.37 48.01,12.32 44.83,12.32 48.39,8.13 39.62,27.69 24.38,27.69 9.14,27.69 30.1,22.61 28.45,14.73 1.4,15.62 1.4,6.48 48.9,43.18 48.9,40.13 48.9,37.08 48.9,34.04 48.9,30.99 48.9,27.94 1.14,43.18 1.14,39.88 0.89,36.58 0.89,33.27 17.65,28.96 32.38,29.46 15.62,25.65 17.65,25.65 32.89,13.34 34.29,13.34 39.75,19.3 40.39,24.28 38.48,18.44 38.1,20.57 38.1,21.84
  pour Top (isolate 0.254, rank 6, no thermals): 0,0 0,50 50,50 50,0
  pour Bottom (isolate 0.254, rank 6, no thermals): 0,0 0,50 50,50 50,0
IN1
  Top 0.254: IC7.19 24.51,13.34 R19.1
IN2
  Top 0.254: IC7.18 24.01,12.19 R20.1
IN3
  Top 0.254: IC7.17 23.51,11.82 R21.1
IN4
  Top 0.254: IC7.16 23.01,12.97 R22.1
INT  (via drill 0.3)
  Top 0.254: IC7.3 21.36,22.07 23.24,20.19 23.24,19.81 v25.4,17.65
  Bottom 0.254: IMU.1 38.86,5.84 38.86,8.38 36.7,10.54 33.27,10.54 29.97,13.84 28.19,13.84 26.42,15.62 25.65,15.62 25.4,15.88 v25.4,17.65
LEDA  (via drill 0.3)
  Top 0.254: IC7.41 25.01,23.23 v24.77,22.99
  Bottom 0.254: v24.77,22.99 23.5,21.72 18.8,21.72 17.91,22.61 12.45,22.61 12.19,22.86 10.29,22.86 9.65,22.23 8.13,22.23 A.A
  other vias: 7.37,22.99
LEDB  (via drill 0.3)
  Top 0.254: IC7.42 24.51,23.75 v23.75,22.99
  Bottom 0.254: v23.75,22.99 22.99,22.23 19.05,22.23 18.16,23.11 12.7,23.11 12.45,23.37 9.53,23.37 B.A
  other vias: 9.14,22.99
MISO
  Top 0.254: IC7.27 29.69,18.57 30.35,17.91 33.02,17.91 34.92,16 IC12.2
MOSI
  Top 0.254: IC7.28 29.95,19.07 30.48,18.54 IC12.5
N$1  (via drill 0.3)
  Top 0.203: v14.86,38.1 14.86,36.2 15.37,35.69 15.88,35.69 16.15,35.41 16.15,31.98 R5.1
  Bottom 0.203: IC1.19 14.22,38.73 v14.86,38.1
N$2
  Top 0.254: Q5.4 26.92,32.89 R9.2
N$3
  Top 0.254: Q5.2 24.38,32.89 R10.2
N$4
  Top 0.254: Q2.4 11.68,32.89 R3.2
N$5
  Top 0.254: Q2.2 9.14,32.89 R4.2
N$6
  Top 0.254: Q3.4 16.76,32.89 R5.2
N$7
  Top 0.254: Q3.2 14.22,32.89 R6.2
N$8
  Bottom 0.203: IC4.5 11.8,26.28 12.95,27.43 IC1.3
N$9  (via drill 0.3)
  Bottom 0.254: IC1.20 15.49,41.78 C1.1
  other vias: 15.11,42.16
N$10  (via drill 0.3)
  Bottom 0.254: IC1.16 10.41,41.78 C2.1
  other vias: 10.03,42.16
N$11
  Bottom 0.254: C3.1 4.06,29.08 IC1.10 4.06,33.27 3.05,34.29 2.54,34.29 D3.C
N$12
  Top 0.254: Q6.4 32,32.89 R11.2
N$13
  Top 0.254: Q6.2 29.46,32.89 R12.2
N$14
  Top 0.254: R19.2 26.42,7.87 IN4.1
N$15
  Top 0.254: Q1.4 6.6,32.89 R1.2
N$16
  Top 0.254: Q1.2 4.06,32.89 R2.2
N$17
  Bottom 0.203: IC4.7 10.8,25.65 11.56,24.89 12.83,24.89 15.49,27.56 IC1.1
N$18
  Top 0.254: R35.1 PWR.C
N$19
  Bottom 0.203: IC4.2 10.8,29.71 10.41,30.1 IC1.5
N$20
  Top 0.254: R36.1 ON.C
N$21
  Top 0.254: USB.2 9.18,11.85 R23.2
N$22
  Top 0.254: R37.1 A.C
N$23  (via drill 0.3)
  Bottom 0.254: IC2.20 30.73,41.78 C5.1
  other vias: 30.35,42.16
N$24  (via drill 0.3)
  Bottom 0.254: IC2.16 25.65,41.78 C6.1
  other vias: 25.27,42.16
N$25  (via drill 0.3)
  Top 0.203: v12.45,38.1 12.45,36.32 13.64,35.13 13.64,31.95 R6.1
  Bottom 0.203: IC1.17 11.68,38.86 v12.45,38.1
N$26  (via drill 0.3)
  Top 0.203: R3.1 11.07,31.98 11.07,35.41 10.79,35.69 10.29,35.69 9.78,36.2 v9.78,38.1
  Bottom 0.203: IC1.15 9.14,38.73 v9.78,38.1
N$27  (via drill 0.3)
  Top 0.203: v7.37,38.1 7.37,36.32 8.56,35.13 8.56,31.95 R4.1
  Bottom 0.203: IC1.13 6.6,38.86 v7.37,38.1
N$28  (via drill 0.3)
  Top 0.203: R2.1 5.08,30.35 6.73,30.35 v7.87,29.21
  Bottom 0.203: v7.87,29.21 IC1.7
N$29  (via drill 0.3)
  Top 0.203: v5.46,32.26 5.71,32.26 R1.1
  Bottom 0.203: IC1.9 5.33,32.13 v5.46,32.26
N$30
  Bottom 0.254: C7.1 19.3,29.08 IC2.10 19.3,33.27 18.29,34.29 17.78,34.29 D6.C
N$31
  Top 0.254: Q4.4 21.84,32.89 R7.2
N$32
  Top 0.254: Q4.2 19.3,32.89 R8.2
N$33
  Bottom 0.203: IC5.7 26.04,25.52 26.67,24.89 28.07,24.89 30.73,27.56 IC2.1
N$34
  Top 0.254: R20.2 24.77,8.76 IN3.1
N$35
  Bottom 0.203: IC5.5 27.04,26.28 28.19,27.43 IC2.3
N$36
  Top 0.254: USB.3 8.89,11.05 R24.2
N$37
  Bottom 0.203: IC5.2 26.04,29.71 25.65,30.1 IC2.5
N$38
  Top 0.254: R21.2 20.95,7.75 IN2.1
N$39  (via drill 0.3)
  Top 0.203: v27.69,38.1 27.69,36.32 28.88,35.13 28.88,31.95 R12.1
  Bottom 0.203: IC2.17 26.92,38.86 v27.69,38.1
N$40  (via drill 0.3)
  Top 0.203: v25.02,38.1 25.02,36.2 25.53,35.69 26.04,35.69 26.31,35.41 26.31,31.98 R9.1
  Bottom 0.203: IC2.15 24.38,38.73 v25.02,38.1
N$41  (via drill 0.3)
  Top 0.203: v22.61,38.1 22.61,36.32 23.8,35.13 23.8,31.95 R10.1
  Bottom 0.203: IC2.13 21.84,38.86 v22.61,38.1
N$42  (via drill 0.3)
  Top 0.254: R8.1 20.45,30.23 22.1,30.23 v23.11,29.21
  Bottom 0.254: v23.11,29.21 IC2.7
N$43  (via drill 0.3)
  Top 0.254: v20.7,32.26 20.95,32.26 R7.1
  Bottom 0.254: IC2.9 20.57,32.13 v20.7,32.26
N$44  (via drill 0.3)
  Top 0.203: v30.1,38.1 30.1,36.2 30.61,35.69 31.11,35.69 31.39,35.41 31.39,31.98 R11.1
  Bottom 0.203: IC2.19 29.46,38.73 v30.1,38.1
N$45
  Top 0.254: Q8.4 42.16,32.89 R15.2
N$46
  Top 0.254: Q8.2 39.62,32.89 R16.2
N$47
  Top 0.254: Q9.4 47.24,32.89 R17.2
N$48
  Top 0.254: Q9.2 44.7,32.89 R18.2
N$49
  Top 0.254: R22.2 20.57,9.02 20.07,9.02 18.8,7.75 IN1.1
N$50  (via drill 0.3)
  Bottom 0.254: IC3.20 45.97,41.78 C9.1
  other vias: 45.59,42.16
N$51  (via drill 0.3)
  Bottom 0.254: IC3.16 40.89,41.78 C10.1
  other vias: 40.51,42.16
N$52
  Bottom 0.254: C11.1 34.54,29.08 IC3.10 34.54,33.27 33.53,34.29 33.02,34.29 D9.C
N$53
  Top 0.254: Q7.4 37.08,32.89 R13.2
N$54
  Top 0.254: Q7.2 34.54,32.89 R14.2
N$55
  Bottom 0.203: IC6.7 41.28,25.52 41.91,24.89 43.18,24.89 43.94,25.65 43.94,26.67 45.97,28.7 IC3.1
N$56
  Top 0.406: USB.1 8.33,12.65 8.76,13.08 9.14,13.08 L1.2
N$57
  Bottom 0.203: 42.28,26.28 IC6.5 42.29,26.54 43.18,27.43 43.18,29.21 43.43,29.46 IC3.3
N$58
  Top 0.254: R38.1 B.C
N$59
  Bottom 0.203: IC6.2 41.28,29.71 40.89,30.1 IC3.5
N$60
  Bottom 0.254: BUZZ.2 29.34,8.17 T1.C 27.86,9.65 25.27,9.65 D11.C
N$61  (via drill 0.3)
  Top 0.203: v42.93,38.1 42.93,36.32 44.12,35.13 44.12,31.95 R18.1
  Bottom 0.203: IC3.17 42.16,38.86 v42.93,38.1
N$62  (via drill 0.3)
  Top 0.203: v40.26,38.1 40.26,36.2 40.77,35.69 41.27,35.69 41.55,35.41 41.55,31.98 R15.1
  Bottom 0.203: IC3.15 39.62,38.73 v40.26,38.1
N$63  (via drill 0.3)
  Top 0.203: v37.85,38.1 37.85,36.32 39.04,35.13 39.04,31.95 R16.1
  Bottom 0.203: IC3.13 37.08,38.86 v37.85,38.1
N$64  (via drill 0.3)
  Top 0.254: R14.1 34.8,31.24 35.81,30.23 37.34,30.23 v38.35,29.21
  Bottom 0.254: v38.35,29.21 IC3.7
N$65  (via drill 0.3)
  Top 0.254: v35.94,32.26 36.2,32.26 R13.1
  Bottom 0.254: IC3.9 35.81,32.13 v35.94,32.26
N$66  (via drill 0.3)
  Top 0.203: v45.34,38.1 45.34,36.45 46.63,35.15 46.63,31.98 R17.1
  Bottom 0.203: IC3.19 44.7,38.73 v45.34,38.1
N$68
  Bottom 0.406: IC11.6 10.92,19.18 C28.1
N$69
  Bottom 0.406: IC11.3 7.56,16.96 7.95,17.35 10.87,17.35 C28.2
N$70
  Top 0.203: RX.PAD 34.16,27.05 R28.1
N$71
  Top 0.203: R29.1 35.69,27.05 TX.PAD
N$72
  Bottom 0.254: R39.2 R40.1 26.99,11.87 T1.B
N$76
  Top 0.508: IC10.4 C40.1
N$77
  Top 0.508: IC9.4 36,13.15 C36.1
NRST  (via drill 0.3)
  Top 0.254: v23.37,17.65 22.23,18.8 22.23,19.68 21.84,20.07 IC7.7 18.04,20.07 17.78,19.81 17.78,19.3 17.02,18.54 13.08,18.54 12.32,19.3 12.32,22.48 11.94,22.86 11.05,22.86 10.03,23.88 4.7,23.88 3.81,24.77 3.81,26.92 1.91,28.83 SWD.5
  Bottom 0.254: C45.1 R34.2 26.42,18.41 24.13,18.41 v23.37,17.65
NSS
  Top 0.254: IC12.1 35.43,14.73 33.53,16.64 30.1,16.64 R26.1 29.46,16.51 29.46,17.14 29.04,17.57 IC7.25
OSCI
  Top 0.203: C24.1 13.59,24.51 X1.1 16.64,21.97 17.54,21.07 IC7.5
OSCO
  Top 0.203: C25.1 13.59,19.68 X1.2 17.52,20.57 IC7.6
SCK
  Top 0.254: IC7.26 29.43,18.07 30.23,17.27 IC12.6
SCL  (via drill 0.3)
  Top 0.254: IC7.21 25.51,13.86 26.54,12.83 27.43,12.83 28.07,12.19 28.57,12.19 29.21,11.56 29.21,11.3 v29.97,10.54
  Bottom 0.254: IMU.3 36.96,7.49 35.94,8.51 32,8.51 v29.97,10.54
SD  (via drill 0.3)
  Top 0.254: IC7.10 20.73,18.57 v21.46,19.3
  Bottom 0.254: ON.A 7.37,21.21 7.37,20.7 R27.1 | v21.46,19.3 18.92,19.3 17.4,20.83 7.75,20.83 R27.1 | IC11.4 7.56,20.51 R27.1
  other vias: 5.59,22.99
SDA  (via drill 0.3)
  Top 0.254: v29.97,11.56 28.83,12.7 28.32,12.7 27.69,13.34 26.8,13.34 26.01,14.12 IC7.22
  Bottom 0.254: IMU.2 37.47,4.7 37.47,7.75 36.2,9.02 32.51,9.02 v29.97,11.56
SWCLK  (via drill 0.3)
  Top 0.254: IC7.37 27.01,23.83 26.16,22.99 v25.78,22.99 | SWD.2 10.79,21.34 v11.56,22.1
  Bottom 0.254: v25.78,22.99 24,21.21 18.54,21.21 17.65,22.1 v11.56,22.1
SWDIO  (via drill 0.3)
  Top 0.254: IC7.34 27.02,22.07 v26.92,21.97 | SWD.4 3.3,25.02 3.3,22.86 4.06,22.1 v10.54,22.1
  Bottom 0.254: v26.92,21.97 26.54,21.97 25.27,20.7 18.29,20.7 17.65,21.34 11.3,21.34 v10.54,22.1
VBAT  (via drill 0.3)
  Top 0.254: R32.2 R31.1 C43.1 v35.31,20.57 | IC7.12 20.7,17.57 v20.7,16.64
  Bottom 0.254: v35.31,20.57 35.18,20.45 27.94,20.45 26.42,18.92 23.62,18.92 22.23,17.53 21.59,17.53 v20.7,16.64
VBUS
  Top 0.406: D10.2 11.35,15.04 C23.1 L1.1
VCC  (via drill 0.5)
  Top 0.254: R32.1 Q10.1
  Top 1.016: C13.+ 16.64,45.72 16.64,39.62 | C14.+ 31.88,45.72 31.88,39.62
  Bottom 0.406: C14.+ C16.1 | C13.+ C15.1
  Bottom 1.27: v5.46,36.7 v6.48,36.7 v10.67,36.7 v11.56,36.7 v15.75,36.7 v16.64,36.7 v20.7,36.7 v21.72,36.7 v25.91,36.7 v26.8,36.7 v30.99,36.7 v31.88,36.7 v35.94,36.7 v36.96,36.7 v41.15,36.7 v42.04,36.7 v46.35,36.7 v47.24,35.81 47.24,28.45 45.09,26.29 45.09,25.27 42.93,23.11 v42.93,22.73
  other vias: 41.66,21.46 41.66,20.19 42.93,21.46 42.93,20.19 39.12,16.13 41.02,16.13 41.02,14.73 39.12,14.73
  pour Top (no thermals): 5.08,41.02 6.86,41.02 6.86,36.2 5.08,36.2
  pour Top (no thermals): 10.16,41.02 11.94,41.02 11.94,36.2 10.16,36.2
  pour Top (no thermals): 15.24,41.02 17.02,41.02 17.02,36.2 15.24,36.2
  pour Top (no thermals): 20.32,41.02 22.1,41.02 22.1,36.2 20.32,36.2
  pour Top (no thermals): 25.4,41.02 27.18,41.02 27.18,36.2 25.4,36.2
  pour Top (no thermals): 30.48,41.02 32.26,41.02 32.26,36.2 30.48,36.2
  pour Top (no thermals): 35.56,41.02 37.34,41.02 37.34,36.2 35.56,36.2
  pour Top (no thermals): 40.64,41.02 42.42,41.02 42.42,36.2 40.64,36.2
  pour Top (no thermals): 45.72,41.02 47.5,41.02 47.5,35.31 46.61,35.31 45.72,36.2
  pour Top (no thermals): 39.12,23.37 43.56,23.37 43.56,19.56 41.02,19.56 41.02,20.32 39.12,20.32
  pour Bottom (no thermals): 41.02,23.37 43.56,23.37 43.56,19.56 42.67,19.56 42.67,14.22 38.48,14.22 38.48,16.51 41.02,16.51
  pour Top (no thermals): 38.48,16.51 41.78,16.51 41.78,14.22 38.48,14.22
VREG  (via drill 0.3)
  Top 0.406: C39.1 12.06,15.24 12.06,17.53 11.05,18.54 10.54,18.54 D10.3 10.41,20.07 PWR.A
  Top 0.508: IC9.3 36,7.55 C35.1 | IC9.1 34.1,7.93 C34.1 | IC10.1 13.4,14.29 C39.1 | IC10.3 13.78,12.38 C38.1
  Bottom 0.61: v35.69,7.62 C34.1 | C38.1 v13.46,13.97 14.73,15.24 18.8,15.24 21.97,12.06 25.02,12.06 26.42,10.67 28.57,10.67 31.62,7.62 C34.1 | IMU.5 34.42,5.21 C34.1
  other vias: 13.46,12.7 34.42,7.62
  pour Top (no thermals): 34.16,7.87 36.2,7.87 36.2,7.37 34.16,7.37
  pour Top (no thermals): 13.21,12.45 13.21,14.48 13.72,14.48 13.72,12.45

### Text on the board
tPlace: VauTRIO v1.0 | SIG | +5V | +3V3 | GND | +5V | GND | SCL | SDA | INT
bPlace: MOTOR-1 | MOTOR-2 | MOTOR-3 | POWER | VauTRIO v1.0 | designed by / SVentas (2013) | SIG | SIG | +5V | BUZZ | +3V3 | A D C | RECEIVER | GND | I M U